# Altium schematic sheet Auxillary_Supply.SchDoc
size A3
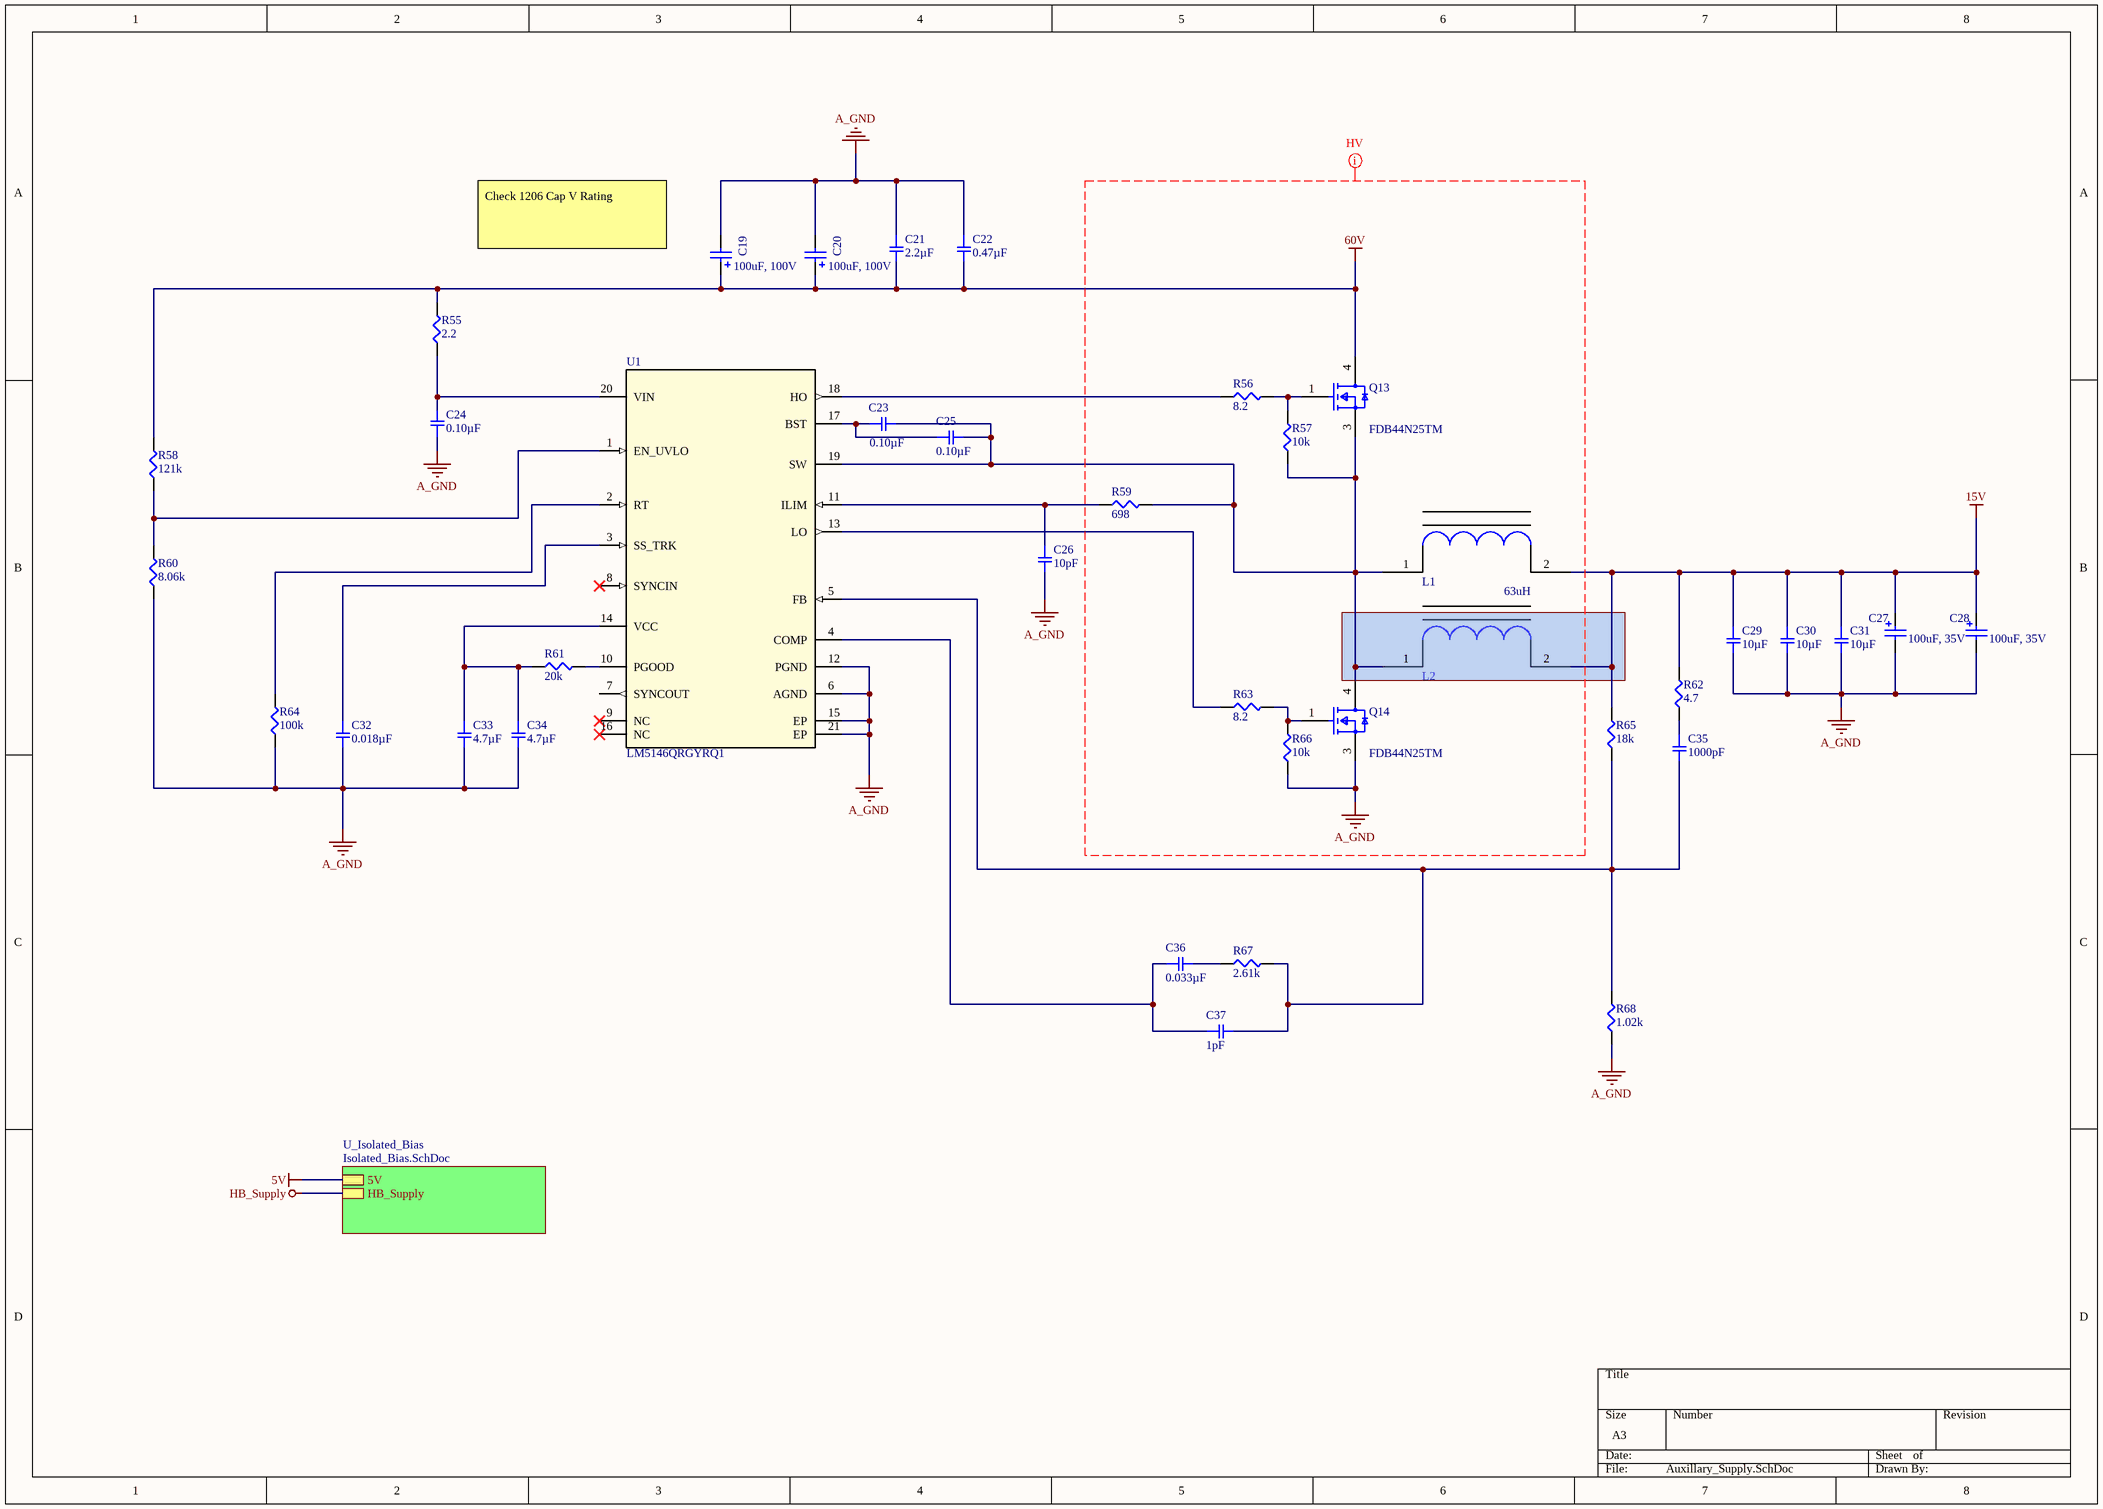
[diagram p0: Auxillary_Supply.SchDoc]

## Parts
C19  100uF, 100V  [WCAP-ATUL_10x25]
C20  100uF, 100V  [WCAP-ATUL_10x25]
C21  2.2µF  [SMD-1210C]
C22  0.47µF  [SMD-1206C]
C23  0.10µF  [SMD-0805C]
C24  0.10µF  [SMD-0805C]
C25  0.10µF  [SMD-0805C]
C26  10pF  [SMD-0805C]
C27  100uF, 35V  [WCAP-ASLL_8x10.5]
C28  100uF, 35V  [WCAP-ASLL_8x10.5]
C29  10µF  [SMD-1210C]
C30  10µF  [SMD-1206C]
C31  10µF  [SMD-1206C]
C32  0.018µF  [SMD-0805C]
C33  4.7µF  [SMD-0805C]
C34  4.7µF  [SMD-0805C]
C35  1000pF  [SMD-0805C]
C36  0.033µF  [SMD-0805C]
C37  1pF  [SMD-0805C]
L1  value 63uH  [SRR1260]  (hidden comment: Inductor)
L2  Inductor  [Inductor 25mm]  (value not drawn)
Q13  FDB44N25TM  [FP-418AJ-MFG]
Q14  FDB44N25TM  [FP-418AJ-MFG]
R55  2.2  [SMD-0805-RES]
R56  8.2  [SMD-0805-RES]
R57  10k  [SMD-0805-RES]
R58  121k  [SMD-0805-RES]
R59  698  [SMD-0805-RES]
R60  8.06k  [SMD-0805-RES]
R61  20k  [SMD-0805-RES]
R62  4.7  [SMD-0805-RES]
R63  8.2  [SMD-0805-RES]
R64  100k  [SMD-0805-RES]
R65  18k  [SMD-0805-RES]
R66  10k  [SMD-0805-RES]
R67  2.61k  [SMD-0805-RES]
R68  1.02k  [SMD-0805-RES]
U1  LM5146QRGYRQ1  [QFN50P350X450X100_HS-21N]

## Sub-sheets
U_Isolated_Bias = Isolated_Bias.SchDoc: 5V, HB_Supply

## Nets
5V: sheet U_Isolated_Bias/5V
15V: C27.2(P) C28.2(P) C29.1 C30.1 C31.1 L1.2 L2.2 R62.2 R65.2
60V: C19.2(P) C20.2(P) C21.2 C22.2 Q13.4(D) R55.2 R58.2
A_GND: C19.1(N) C20.1(N) C21.1 C22.1 C24.1 C26.2 C27.1(N) C28.1(N) C29.2 C30.2 C31.2 C32.2 C33.2 C34.2 Q14.3(S) R60.1 R64.1 R66.1 R68.1 U1.6(AGND) U1.12(PGND) U1.15(EP) U1.21(EP)
HB_Supply: sheet U_Isolated_Bias/HB_Supply
NetC23_1: C23.1 C25.1 U1.17(BST)
NetC23_2: C23.2 C25.2 L1.1 L2.1 Q13.3(S) Q14.4(D) R57.1 R59.2 U1.19(SW)
NetC24_2: C24.2 R55.1 U1.20(VIN)
NetC26_1: C26.1 R59.1 U1.11(ILIM)
NetC32_1: C32.1 U1.3(SS_TRK)
NetC33_1: C33.1 C34.1 R61.1 U1.14(VCC)
NetC35_1: C35.1 R62.1
NetC35_2: C35.2 C37.2 R65.1 R67.2 R68.2 U1.5(FB)
NetC36_1: C36.1 C37.1 U1.4(COMP)
NetC36_2: C36.2 R67.1
NetQ13_1: Q13.1(G) R56.2 R57.2
NetQ14_1: Q14.1(G) R63.2 R66.2
NetR56_1: R56.1 U1.18(HO)
NetR58_1: R58.1 R60.2 U1.1(EN_UVLO)
NetR61_2: R61.2 U1.10(PGOOD)
NetR63_1: R63.1 U1.13(LO)
NetR64_2: R64.2 U1.2(RT)

Not connected (* = marked no-connect by the designer): U1 7(SYNCOUT) 8(SYNCIN)* 9(NC)* 16(NC)*

## Layout directives
net class HV; rule Clearance Constraint [Generic clearance = 30mil, and 18 value(s) for objects]: 60V, A_GND

## Notes on the sheet
- Check 1206 Cap V Rating

## Library data of the parts
C19 C20 = 860040875005: WCAP-ATUL THT Aluminum Electrolytic Capacitors, D10mm x L25mm, 100uF, +/-20%, 100VDC; Dissipation Factor: 9%; Endurance: 7000h; Leakage Current: 100uA; Ripple Current max.: 800mA; Technical Reference: ATDF250101M100DSPAAG000; ComponentLink1Description: Manufacturer; ComponentLink1URL: http://www.we-online.de; ComponentLink2Description: Datasheet; ComponentLink2URL: https://katalog.we-online.com/pbs/datasheet/860040875005.pdf; Length: 25mm; Mounting Technology: THT; Operating Temperature: -40 to +105degC; Packaging: Ammo Pack; Published Date: August 2019; Capacitance: 100uF; Diameter: 10mm; Part Number: 860040875005; Publisher: Wurth Elektronik; Capacitance Tolerance: +/-20%; Rated Voltage: 100VDC
C21 = GCJ32DR72A225KA01L: CAP CER 2.2UF 100V X7R 1210; Manufacturer: Murata Electronics North America; Factory Stock: 0; Unit Price (USD): 1.5; Minimum Quantity: 1; Tolerance: ±10%; Datasheets: http://www.murata.com/~/media/webrenewal/support/library/catalog/products/capacitor/mlcc/c03e.ashx; Image: //media.digikey.com/Renders/Murata%20Renders/1210-32R.jpg; Digi-Key Part Number: 490-5840-1-ND; Part Number: GCJ32DR72A225KA01L; Quantity Available: 84171; @ qty: 0; Packaging: Cut Tape (CT); Series: GCJ; Part Status: Active; Value: 2.2µF; Voltage: 100V; Temperature Coefficient: X7R; Operating Temperature: -55°C ~ 125°C; Features: Soft Termination; Ratings: AEC-Q200; Applications: Automotive, Boardflex Sensitive; Failure Rate: Surface Mount, MLCC; Mounting Type: 1210 (3225 Metric); Package / Case: 0.126" L x 0.098" W (3.20mm x 2.50mm); Size / Dimension: -; Height - Seated (Max): 0.079" (2.00mm); Thickness (Max): -; Lead Spacing: -
C22 = GRM31MR72A474KA35L: CAP CER 0.47UF 100V X7R 1206; Manufacturer: Murata Electronics North America; Factory Stock: 0; Unit Price (USD): 0.7; Minimum Quantity: 1; Tolerance: ±10%; Datasheets: http://www.murata.com/~/media/webrenewal/support/library/catalog/products/capacitor/mlcc/c02e.pdf; Image: //media.digikey.com/Renders/Murata%20Renders/GR331BD72E473KW01L.jpg; Digi-Key Part Number: 490-11647-1-ND; Part Number: GRM31MR72A474KA35L; Quantity Available: 7752; @ qty: 0; Packaging: Cut Tape (CT); Series: GRM; Part Status: Active; Value: 0.47µF; Voltage: 100V; Temperature Coefficient: X7R; Operating Temperature: -55°C ~ 125°C; Features: -; Ratings: -; Applications: General Purpose; Mounting Type: Surface Mount, MLCC; Package / Case: 1206 (3216 Metric); Size / Dimension: 0.126" L x 0.063" W (3.20mm x 1.60mm); Height - Seated (Max): -; Thickness (Max): 0.049" (1.25mm); Lead Spacing: -; Lead Style: -
C23-C25 = GRM21BR71E104KA01L: CAP CER 0.1UF 25V X7R 0805; Manufacturer: Murata Electronics North America; Factory Stock: 0; Unit Price (USD): 0.19; Minimum Quantity: 1; Tolerance: ±10%; Datasheets: http://www.murata.com/~/media/webrenewal/support/library/catalog/products/capacitor/mlcc/c02e.pdf; Image: //media.digikey.com/Renders/Murata%20Renders/0805%20(2012%20Metric)%20.85mm.jpg; Digi-Key Part Number: 490-1673-1-ND; Part Number: GRM21BR71E104KA01L; Quantity Available: 1009396; @ qty: 0; Packaging: Cut Tape (CT); Series: GRM; Part Status: Active; Value: 0.10µF; Voltage: 25V; Temperature Coefficient: X7R; Operating Temperature: -55°C ~ 125°C; Features: -; Ratings: -; Applications: General Purpose; Mounting Type: Surface Mount, MLCC; Package / Case: 0805 (2012 Metric); Size / Dimension: 0.079" L x 0.049" W (2.00mm x 1.25mm); Height - Seated (Max): -; Thickness (Max): 0.053" (1.35mm); Lead Spacing: -; Lead Style: -
C26 = GQM2195C2A100GB01D: CAP CER 10PF 100V NP0 0805; Manufacturer: Murata Electronics North America; Factory Stock: 0; Unit Price (USD): 0.91; Minimum Quantity: 1; Tolerance: ±2%; Temperature Coefficient: C0G, NP0; Datasheets: http://www.murata.com/~/media/webrenewal/support/library/catalog/products/capacitor/mlcc/c02e.pdf; Image: //media.digikey.com/Renders/Murata%20Renders/0805(GxM9).jpg; Digi-Key Part Number: 490-6098-1-ND; Part Number: GQM2195C2A100GB01D; Quantity Available: 3211; @ qty: 0; Packaging: Cut Tape (CT); Series: GQM; Part Status: Active; Value: 10pF; Voltage: 100V; Operating Temperature: -55°C ~ 125°C; Features: High Q, Low Loss; Ratings: -; Applications: RF, Microwave, High Frequency; Mounting Type: Surface Mount, MLCC; Package / Case: 0805 (2012 Metric); Size / Dimension: 0.079" L x 0.049" W (2.00mm x 1.25mm); Height - Seated (Max): -; Thickness (Max): 0.037" (0.95mm); Lead Spacing: -; Lead Style: -
C27 C28 = 865060553006: WCAP-ASLL SMT Aluminum Electrolytic Capacitors, D8mm x L10.5mm, 100uF, +/-20%, 35VDC; Dissipation Factor: 14%; Endurance: 5000h; Leakage Current: 35uA; Ripple Current max.: 450mA; Technical Reference: ASEE105101M035DVCTEE000; ComponentLink1Description: Manufacturer; ComponentLink1URL: http://www.we-online.de; ComponentLink2Description: Datasheet; ComponentLink2URL: https://katalog.we-online.com/pbs/datasheet/865060553006.pdf; Length: 10.5mm; Mounting Technology: SMT; Operating Temperature: -55 to +105degC; Packaging: Tape and Reel; Published Date: August 2019; Capacitance: 100uF; Diameter: 8mm; Part Number: 865060553006; Publisher: Wurth Elektronik; Capacitance Tolerance: +/-20%; Rated Voltage: 35VDC
C29 = GRM32DR61E106MA12L: CAP CER 10UF 25V X5R 1210; Manufacturer: Murata Electronics North America; Factory Stock: 0; Unit Price (USD): 0.5; Minimum Quantity: 1; Tolerance: ±20%; Datasheets: http://www.murata.com/~/media/webrenewal/support/library/catalog/products/capacitor/mlcc/c02e.pdf; Image: //media.digikey.com/Renders/Murata%20Renders/1210-3225-16.jpg; Digi-Key Part Number: 490-6530-1-ND; Part Number: GRM32DR61E106MA12L; Quantity Available: 29124; @ qty: 0; Packaging: Cut Tape (CT); Series: GRM; Part Status: Active; Value: 10µF; Voltage: 25V; Temperature Coefficient: X5R; Operating Temperature: -55°C ~ 85°C; Features: -; Ratings: -; Applications: General Purpose; Failure Rate: Surface Mount, MLCC; Mounting Type: 1210 (3225 Metric); Package / Case: 0.126" L x 0.098" W (3.20mm x 2.50mm); Size / Dimension: -; Height - Seated (Max): 0.087" (2.20mm); Thickness (Max): -; Lead Spacing: -
C30 C31 = GRM31CR71E106MA12L: CAP CER 10UF 25V X7R 1206; Manufacturer: Murata Electronics North America; Factory Stock: 0; Unit Price (USD): 0.25; Minimum Quantity: 1; Tolerance: ±20%; Datasheets: http://www.murata.com/~/media/webrenewal/support/library/catalog/products/capacitor/mlcc/c02e.pdf; Image: //media.digikey.com/Renders/Murata%20Renders/GR331BD72E473KW01L.jpg; Digi-Key Part Number: 490-6519-1-ND; Part Number: GRM31CR71E106MA12L; Quantity Available: 42201; @ qty: 0; Packaging: Cut Tape (CT); Series: GRM; Part Status: Active; Value: 10µF; Voltage: 25V; Temperature Coefficient: X7R; Operating Temperature: -55°C ~ 125°C; Features: -; Ratings: -; Applications: General Purpose; Mounting Type: Surface Mount, MLCC; Package / Case: 1206 (3216 Metric); Size / Dimension: 0.126" L x 0.063" W (3.20mm x 1.60mm); Height - Seated (Max): -; Thickness (Max): 0.071" (1.80mm); Lead Spacing: -; Lead Style: -
C32 = GRM21BR72A183KA01L: CAP CER 0.018UF 100V X7R 0805; Manufacturer: Murata Electronics North America; Factory Stock: 0; Unit Price (USD): 0.21; Minimum Quantity: 1; Tolerance: ±10%; Datasheets: http://www.murata.com/~/media/webrenewal/support/library/catalog/products/capacitor/mlcc/c02e.pdf; Image: //media.digikey.com/Renders/Murata%20Renders/0805%20(2012%20Metric)%20.85mm.jpg; Digi-Key Part Number: 490-1657-1-ND; Part Number: GRM21BR72A183KA01L; Quantity Available: 8214; @ qty: 0; Packaging: Cut Tape (CT); Series: GRM; Part Status: Active; Value: 0.018µF; Voltage: 100V; Temperature Coefficient: X7R; Operating Temperature: -55°C ~ 125°C; Features: -; Ratings: -; Applications: General Purpose; Mounting Type: Surface Mount, MLCC; Package / Case: 0805 (2012 Metric); Size / Dimension: 0.079" L x 0.049" W (2.00mm x 1.25mm); Height - Seated (Max): -; Thickness (Max): 0.053" (1.35mm); Lead Spacing: -; Lead Style: -
C33 C34 = GCJ21BR71C475KA01L: CAP CER 4.7UF 16V X7R 0805; Manufacturer: Murata Electronics North America; Factory Stock: 0; Unit Price (USD): 0.44; Minimum Quantity: 1; Tolerance: ±10%; Datasheets: http://www.murata.com/~/media/webrenewal/support/library/catalog/products/capacitor/mlcc/c03e.ashx; Image: //media.digikey.com/Renders/Murata%20Renders/0805%20(2012%20Metric)%20.85mm.jpg; Digi-Key Part Number: 490-10557-1-ND; Part Number: GCJ21BR71C475KA01L; Quantity Available: 53217; @ qty: 0; Packaging: Cut Tape (CT); Series: GCJ; Part Status: Active; Value: 4.7µF; Voltage: 16V; Temperature Coefficient: X7R; Operating Temperature: -55°C ~ 125°C; Features: Soft Termination; Ratings: AEC-Q200; Applications: Automotive, Boardflex Sensitive; Mounting Type: Surface Mount, MLCC; Package / Case: 0805 (2012 Metric); Size / Dimension: 0.079" L x 0.049" W (2.00mm x 1.25mm); Height - Seated (Max): -; Thickness (Max): 0.057" (1.45mm); Lead Spacing: -; Lead Style: -
C35 = GCJ216R71H102KA01D: CAP CER 1000PF 50V X7R 0805; Manufacturer: Murata Electronics North America; Factory Stock: 0; Unit Price (USD): 0.24; Minimum Quantity: 1; Tolerance: ±10%; Datasheets: http://www.murata.com/~/media/webrenewal/support/library/catalog/products/capacitor/mlcc/c03e.ashx; Image: //media.digikey.com/Renders/Murata%20Renders/0805%20(2012%20Metric)%20.85mm.jpg; Digi-Key Part Number: 490-5813-1-ND; Part Number: GCJ216R71H102KA01D; Quantity Available: 3433; @ qty: 0; Packaging: Cut Tape (CT); Series: GCJ; Part Status: Active; Value: 1000pF; Voltage: 50V; Temperature Coefficient: X7R; Operating Temperature: -55°C ~ 125°C; Features: Soft Termination; Ratings: AEC-Q200; Applications: Automotive, Boardflex Sensitive; Mounting Type: Surface Mount, MLCC; Package / Case: 0805 (2012 Metric); Size / Dimension: 0.079" L x 0.049" W (2.00mm x 1.25mm); Height - Seated (Max): -; Thickness (Max): 0.024" (0.60mm); Lead Spacing: -; Lead Style: -
C36 = GCJ219R71H333KA01D: CAP CER 0.033UF 50V X7R 0805; Manufacturer: Murata Electronics North America; Factory Stock: 0; Unit Price (USD): 0.29; Minimum Quantity: 1; Tolerance: ±10%; Datasheets: http://www.murata.com/~/media/webrenewal/support/library/catalog/products/capacitor/mlcc/c03e.ashx; Image: //media.digikey.com/Renders/Murata%20Renders/0805%20(2012%20Metric)%20.85mm.jpg; Digi-Key Part Number: 490-5846-1-ND; Part Number: GCJ219R71H333KA01D; Quantity Available: 2881; @ qty: 0; Packaging: Cut Tape (CT); Series: GCJ; Part Status: Active; Value: 0.033µF; Voltage: 50V; Temperature Coefficient: X7R; Operating Temperature: -55°C ~ 125°C; Features: Soft Termination; Ratings: AEC-Q200; Applications: Automotive, Boardflex Sensitive; Mounting Type: Surface Mount, MLCC; Package / Case: 0805 (2012 Metric); Size / Dimension: 0.079" L x 0.049" W (2.00mm x 1.25mm); Height - Seated (Max): -; Thickness (Max): 0.033" (0.85mm); Lead Spacing: -; Lead Style: -
C37 = GQM2195C2A1R0BB01D: CAP CER 1PF 100V NP0 0805; Manufacturer: Murata Electronics North America; Factory Stock: 0; Unit Price (USD): 0.82; Minimum Quantity: 1; Tolerance: ±0.1pF; Temperature Coefficient: C0G, NP0; Datasheets: http://www.murata.com/~/media/webrenewal/support/library/catalog/products/capacitor/mlcc/c02e.pdf; Image: //media.digikey.com/Renders/Murata%20Renders/0805(GxM9).jpg; Digi-Key Part Number: 490-6099-1-ND; Part Number: GQM2195C2A1R0BB01D; Quantity Available: 1739; @ qty: 0; Packaging: Cut Tape (CT); Series: GQM; Part Status: Active; Value: 1pF; Voltage: 100V; Operating Temperature: -55°C ~ 125°C; Features: High Q, Low Loss; Ratings: -; Applications: RF, Microwave, High Frequency; Mounting Type: Surface Mount, MLCC; Package / Case: 0805 (2012 Metric); Size / Dimension: 0.079" L x 0.049" W (2.00mm x 1.25mm); Height - Seated (Max): -; Thickness (Max): 0.037" (0.95mm); Lead Spacing: -; Lead Style: -
Q13 Q14 = CMP-07173-000078-1: MOSFET N-CH 250V 44A D2PAK; Manufacturer: ON Semi; Number Of Channels: 1; Turn Off Delay Time: 85ns; Power Dissipation: 307W; Turn On Delay Time: 55ns; Gate Charge At Vgs: 47nC @ 10V; Gate To Source Voltage: 30V; Reverse Recovery Time: 195ns; Threshold Vgs Max: 5V; Drain To Source Resistance: 0.058Ω; Max Junction Temp: +150°C; Reverse Recovery Charge: 1800nC; Input Capacitace At Vds: 2210pF @ 25V; Standoff Height: 0mm; Threshold Vgs Min: 3V; Transconductance: 32S; Depletion Mode: False; Rthja Max: 62.5°C/W; Pulse Drain Current: 176A; Max Forward Diode Voltage: 1.4V; Octopart: https://octopart.com/fdb44n25tm-on+semiconductor-84325676; Lead Free: Yes; Drain To Source Breakdown Voltage: 250V; RoHS: TRUE; Device Class L2: Transistors; ComponentLink2URL: https://www.onsemi.com/pub/Collateral/FDB44N25-D.pdf; Digikey Description: MOSFET N-CH 250V 44A D2PAK; Device Class L1: Discrete Semiconductors; Continuous Drain Current: 44A; Temperature: -55°C to +150°C; Footprint Url: https://www.onsemi.com/pub/Collateral/418AJ.PDF; Temperature Range High: +150°C; Automotive: No; Package: 418AJ; Category: Trans; ComponentLink2Description: Datasheet; Height: 4.83mm; Number Of N Channels: 1; Manufacturer Part Number: FDB44N25TM; Drain To Source Voltage: 250V; Temperature Range Low: -55°C; Device Class L3: MOSFETs; Mouser Description: ON SEMICONDUCTOR - FDB44N25TM - MOSFET, N-CH, 250V, 44A, TO-263AB-2; Technology: Si
R55 = ERJ-6BQF2R2V: RES SMD 2.2 OHM 1% 1/3W 0805; Manufacturer: Panasonic Electronic Components; Factory Stock: 0; Unit Price (USD): 0.05834; @ qty: 1500; Minimum Quantity: 1; Power (Watts): 0.333W, 1/3W; Temperature Coefficient: ±200ppm/°C; Part Number: ERJ-6BQF2R2V; Datasheets: https://industrial.panasonic.com/cdbs/www-data/pdf/RDA0000/AOA0000C239.pdf; Image: //media.digikey.com/Renders/Panasonic%20Renders/ERJ-0805%20Pkg.jpg; Digi-Key Part Number: P17504CT-ND; Quantity Available: 8127; Packaging: Cut Tape (CT); Series: ERJ; Part Status: Active; Value: 2.2; Tolerance: ±1%; Composition: Thick Film; Features: Automotive AEC-Q200, Current Sense; Operating Temperature: -55°C ~ 125°C; Package / Case: 0805 (2012 Metric); Supplier Device Package: 0805; Size / Dimension: 0.079" L x 0.049" W (2.00mm x 1.25mm); Height - Seated (Max): 0.028" (0.70mm); Number of Terminations: 2; Failure Rate: -
R56 R63 = ERJ-6BQF8R2V: RES SMD 8.2 OHM 1% 1/3W 0805; Manufacturer: Panasonic Electronic Components; Factory Stock: 0; Unit Price (USD): 0.05834; @ qty: 1500; Minimum Quantity: 1; Power (Watts): 0.333W, 1/3W; Temperature Coefficient: ±200ppm/°C; Part Number: ERJ-6BQF8R2V; Datasheets: https://industrial.panasonic.com/cdbs/www-data/pdf/RDA0000/AOA0000C239.pdf; Image: //media.digikey.com/Renders/Panasonic%20Renders/ERJ-0805%20Pkg.jpg; Digi-Key Part Number: P17514CT-ND; Quantity Available: 6710; Packaging: Cut Tape (CT); Series: ERJ; Part Status: Active; Value: 8.2; Tolerance: ±1%; Composition: Thick Film; Features: Automotive AEC-Q200, Current Sense; Operating Temperature: -55°C ~ 125°C; Package / Case: 0805 (2012 Metric); Supplier Device Package: 0805; Size / Dimension: 0.079" L x 0.049" W (2.00mm x 1.25mm); Height - Seated (Max): 0.028" (0.70mm); Number of Terminations: 2; Failure Rate: -
R57 R66 = ERJ-6ENF1002V: RES SMD 10K OHM 1% 1/8W 0805; Manufacturer: Panasonic Electronic Components; Factory Stock: 0; Unit Price (USD): 0.00729; @ qty: 1500; Minimum Quantity: 1; Power (Watts): 0.125W, 1/8W; Temperature Coefficient: ±100ppm/°C; Part Number: ERJ-6ENF1002V; Datasheets: http://industrial.panasonic.com/www-cgi/jvcr13pz.cgi?E+PZ+3+AOA0002+ERJ6ENF1002V+7+WW; Image: //media.digikey.com/Renders/Panasonic%20Renders/ERJ-0805%20Pkg.jpg; Digi-Key Part Number: P10.0KCCT-ND; Quantity Available: 3985614; Packaging: Cut Tape (CT); Series: ERJ; Part Status: Active; Value: 10k; Tolerance: ±1%; Composition: Thick Film; Features: Automotive AEC-Q200; Operating Temperature: -55°C ~ 155°C; Package / Case: 0805 (2012 Metric); Supplier Device Package: 0805; Size / Dimension: 0.079" L x 0.049" W (2.00mm x 1.25mm); Height - Seated (Max): 0.028" (0.70mm); Number of Terminations: 2; Failure Rate: -
R58 = ERJ-6ENF1213V: RES SMD 121K OHM 1% 1/8W 0805; Manufacturer: Panasonic Electronic Components; Factory Stock: 0; Unit Price (USD): 0.00729; @ qty: 1500; Minimum Quantity: 1; Power (Watts): 0.125W, 1/8W; Temperature Coefficient: ±100ppm/°C; Part Number: ERJ-6ENF1213V; Datasheets: http://industrial.panasonic.com/www-cgi/jvcr13pz.cgi?E+PZ+3+AOA0002+ERJ6ENF1213V+7+WW; Image: //media.digikey.com/Renders/Panasonic%20Renders/ERJ-0805%20Pkg.jpg; Digi-Key Part Number: P121KCCT-ND; Quantity Available: 49210; Packaging: Cut Tape (CT); Series: ERJ; Part Status: Active; Value: 121k; Tolerance: ±1%; Composition: Thick Film; Features: Automotive AEC-Q200; Operating Temperature: -55°C ~ 155°C; Package / Case: 0805 (2012 Metric); Supplier Device Package: 0805; Size / Dimension: 0.079" L x 0.049" W (2.00mm x 1.25mm); Height - Seated (Max): 0.028" (0.70mm); Number of Terminations: 2; Failure Rate: -
R59 = ERJ-6ENF6980V: RES SMD 698 OHM 1% 1/8W 0805; Manufacturer: Panasonic Electronic Components; Factory Stock: 0; Unit Price (USD): 0.00729; @ qty: 1500; Minimum Quantity: 1; Power (Watts): 0.125W, 1/8W; Temperature Coefficient: ±100ppm/°C; Part Number: ERJ-6ENF6980V; Datasheets: http://industrial.panasonic.com/www-cgi/jvcr13pz.cgi?E+PZ+3+AOA0002+ERJ6ENF6980V+7+WW; Image: //media.digikey.com/Renders/Panasonic%20Renders/ERJ-0805%20Pkg.jpg; Digi-Key Part Number: P698CCT-ND; Quantity Available: 22584; Packaging: Cut Tape (CT); Series: ERJ; Part Status: Active; Value: 698; Tolerance: ±1%; Composition: Thick Film; Features: Automotive AEC-Q200; Operating Temperature: -55°C ~ 155°C; Package / Case: 0805 (2012 Metric); Supplier Device Package: 0805; Size / Dimension: 0.079" L x 0.049" W (2.00mm x 1.25mm); Height - Seated (Max): 0.028" (0.70mm); Number of Terminations: 2; Failure Rate: -
R60 = ERJ-6ENF8061V: RES SMD 8.06K OHM 1% 1/8W 0805; Manufacturer: Panasonic Electronic Components; Factory Stock: 0; Unit Price (USD): 0.00729; @ qty: 1500; Minimum Quantity: 1; Power (Watts): 0.125W, 1/8W; Temperature Coefficient: ±100ppm/°C; Part Number: ERJ-6ENF8061V; Datasheets: http://industrial.panasonic.com/www-cgi/jvcr13pz.cgi?E+PZ+3+AOA0002+ERJ6ENF8061V+7+WW; Image: //media.digikey.com/Renders/Panasonic%20Renders/ERJ-0805%20Pkg.jpg; Digi-Key Part Number: P8.06KCCT-ND; Quantity Available: 36710; Packaging: Cut Tape (CT); Series: ERJ; Part Status: Active; Value: 8.06k; Tolerance: ±1%; Composition: Thick Film; Features: Automotive AEC-Q200; Operating Temperature: -55°C ~ 155°C; Package / Case: 0805 (2012 Metric); Supplier Device Package: 0805; Size / Dimension: 0.079" L x 0.049" W (2.00mm x 1.25mm); Height - Seated (Max): 0.028" (0.70mm); Number of Terminations: 2; Failure Rate: -
R61 = ERJ-6ENF2002V: RES SMD 20K OHM 1% 1/8W 0805; Manufacturer: Panasonic Electronic Components; Factory Stock: 0; Unit Price (USD): 0.00729; @ qty: 1500; Minimum Quantity: 1; Power (Watts): 0.125W, 1/8W; Temperature Coefficient: ±100ppm/°C; Part Number: ERJ-6ENF2002V; Datasheets: http://industrial.panasonic.com/www-cgi/jvcr13pz.cgi?E+PZ+3+AOA0002+ERJ6ENF2002V+7+WW; Image: //media.digikey.com/Renders/Panasonic%20Renders/ERJ-0805%20Pkg.jpg; Digi-Key Part Number: P20.0KCCT-ND; Quantity Available: 208257; Packaging: Cut Tape (CT); Series: ERJ; Part Status: Active; Value: 20k; Tolerance: ±1%; Composition: Thick Film; Features: Automotive AEC-Q200; Operating Temperature: -55°C ~ 155°C; Package / Case: 0805 (2012 Metric); Supplier Device Package: 0805; Size / Dimension: 0.079" L x 0.049" W (2.00mm x 1.25mm); Height - Seated (Max): 0.028" (0.70mm); Number of Terminations: 2; Failure Rate: -
R62 = ERJ-6BQF4R7V: RES SMD 4.7 OHM 1% 1/3W 0805; Manufacturer: Panasonic Electronic Components; Factory Stock: 0; Unit Price (USD): 0.07013; @ qty: 1500; Minimum Quantity: 1; Power (Watts): 0.333W, 1/3W; Temperature Coefficient: ±200ppm/°C; Part Number: ERJ-6BQF4R7V; Datasheets: https://industrial.panasonic.com/cdbs/www-data/pdf/RDA0000/AOA0000C239.pdf; Image: //media.digikey.com/Renders/Panasonic%20Renders/ERJ-0805%20Pkg.jpg; Digi-Key Part Number: P15995CT-ND; Quantity Available: 9150; Packaging: Cut Tape (CT); Series: ERJ; Part Status: Active; Value: 4.7; Tolerance: ±1%; Composition: Thick Film; Features: Automotive AEC-Q200, Current Sense; Operating Temperature: -55°C ~ 125°C; Package / Case: 0805 (2012 Metric); Supplier Device Package: 0805; Size / Dimension: 0.079" L x 0.049" W (2.00mm x 1.25mm); Height - Seated (Max): 0.028" (0.70mm); Number of Terminations: 2; Failure Rate: -
R64 = ERJ-6ENF1003V: RES SMD 100K OHM 1% 1/8W 0805; Manufacturer: Panasonic Electronic Components; Factory Stock: 0; Unit Price (USD): 0.00729; @ qty: 1500; Minimum Quantity: 1; Power (Watts): 0.125W, 1/8W; Temperature Coefficient: ±100ppm/°C; Part Number: ERJ-6ENF1003V; Datasheets: http://industrial.panasonic.com/www-cgi/jvcr13pz.cgi?E+PZ+3+AOA0002+ERJ6ENF1003V+7+WW; Image: //media.digikey.com/Renders/Panasonic%20Renders/ERJ-0805%20Pkg.jpg; Digi-Key Part Number: P100KCCT-ND; Quantity Available: 760677; Packaging: Cut Tape (CT); Series: ERJ; Part Status: Active; Value: 100k; Tolerance: ±1%; Composition: Thick Film; Features: Automotive AEC-Q200; Operating Temperature: -55°C ~ 155°C; Package / Case: 0805 (2012 Metric); Supplier Device Package: 0805; Size / Dimension: 0.079" L x 0.049" W (2.00mm x 1.25mm); Height - Seated (Max): 0.028" (0.70mm); Number of Terminations: 2; Failure Rate: -
R65 = ERJ-6ENF1802V: RES SMD 18K OHM 1% 1/8W 0805; Manufacturer: Panasonic Electronic Components; Factory Stock: 0; Unit Price (USD): 0.00729; @ qty: 1500; Minimum Quantity: 1; Power (Watts): 0.125W, 1/8W; Temperature Coefficient: ±100ppm/°C; Part Number: ERJ-6ENF1802V; Datasheets: http://industrial.panasonic.com/www-cgi/jvcr13pz.cgi?E+PZ+3+AOA0002+ERJ6ENF1802V+7+WW; Image: //media.digikey.com/Renders/Panasonic%20Renders/ERJ-0805%20Pkg.jpg; Digi-Key Part Number: P18.0KCCT-ND; Quantity Available: 28787; Packaging: Cut Tape (CT); Series: ERJ; Part Status: Active; Value: 18k; Tolerance: ±1%; Composition: Thick Film; Features: Automotive AEC-Q200; Operating Temperature: -55°C ~ 155°C; Package / Case: 0805 (2012 Metric); Supplier Device Package: 0805; Size / Dimension: 0.079" L x 0.049" W (2.00mm x 1.25mm); Height - Seated (Max): 0.028" (0.70mm); Number of Terminations: 2; Failure Rate: -
R67 = ERJ-6ENF2611V: RES SMD 2.61K OHM 1% 1/8W 0805; Manufacturer: Panasonic Electronic Components; Factory Stock: 0; Unit Price (USD): 0.00729; @ qty: 1500; Minimum Quantity: 1; Power (Watts): 0.125W, 1/8W; Temperature Coefficient: ±100ppm/°C; Part Number: ERJ-6ENF2611V; Datasheets: http://industrial.panasonic.com/www-cgi/jvcr13pz.cgi?E+PZ+3+AOA0002+ERJ6ENF2611V+7+WW; Image: //media.digikey.com/Renders/Panasonic%20Renders/ERJ-0805%20Pkg.jpg; Digi-Key Part Number: P2.61KCCT-ND; Quantity Available: 42251; Packaging: Cut Tape (CT); Series: ERJ; Part Status: Active; Value: 2.61k; Tolerance: ±1%; Composition: Thick Film; Features: Automotive AEC-Q200; Operating Temperature: -55°C ~ 155°C; Package / Case: 0805 (2012 Metric); Supplier Device Package: 0805; Size / Dimension: 0.079" L x 0.049" W (2.00mm x 1.25mm); Height - Seated (Max): 0.028" (0.70mm); Number of Terminations: 2; Failure Rate: -
R68 = ERJ-6ENF1021V: RES SMD 1.02K OHM 1% 1/8W 0805; Manufacturer: Panasonic Electronic Components; Factory Stock: 0; Unit Price (USD): 0.00729; @ qty: 1500; Minimum Quantity: 1; Power (Watts): 0.125W, 1/8W; Temperature Coefficient: ±100ppm/°C; Part Number: ERJ-6ENF1021V; Datasheets: http://industrial.panasonic.com/www-cgi/jvcr13pz.cgi?E+PZ+3+AOA0002+ERJ6ENF1021V+7+WW; Image: //media.digikey.com/Renders/Panasonic%20Renders/ERJ-0805%20Pkg.jpg; Digi-Key Part Number: P1.02KCCT-ND; Quantity Available: 41456; Packaging: Cut Tape (CT); Series: ERJ; Part Status: Active; Value: 1.02k; Tolerance: ±1%; Composition: Thick Film; Features: Automotive AEC-Q200; Operating Temperature: -55°C ~ 155°C; Package / Case: 0805 (2012 Metric); Supplier Device Package: 0805; Size / Dimension: 0.079" L x 0.049" W (2.00mm x 1.25mm); Height - Seated (Max): 0.028" (0.70mm); Number of Terminations: 2; Failure Rate: -
U1 = LM5146QRGYRQ1: Imported; Manufacturer: Texas Instruments; PartNumber: LM5146QRGYRQ1; RefDes: RefDes; Type: DEV; Value: Value; Manufacturer_Part_Number: LM5146QRGYRQ1; Manufacturer_Name: Texas Instruments